# Altium schematic sheet Mainboard.SchDoc
size A4; SheetNumber: 2; SheetTotal: 2
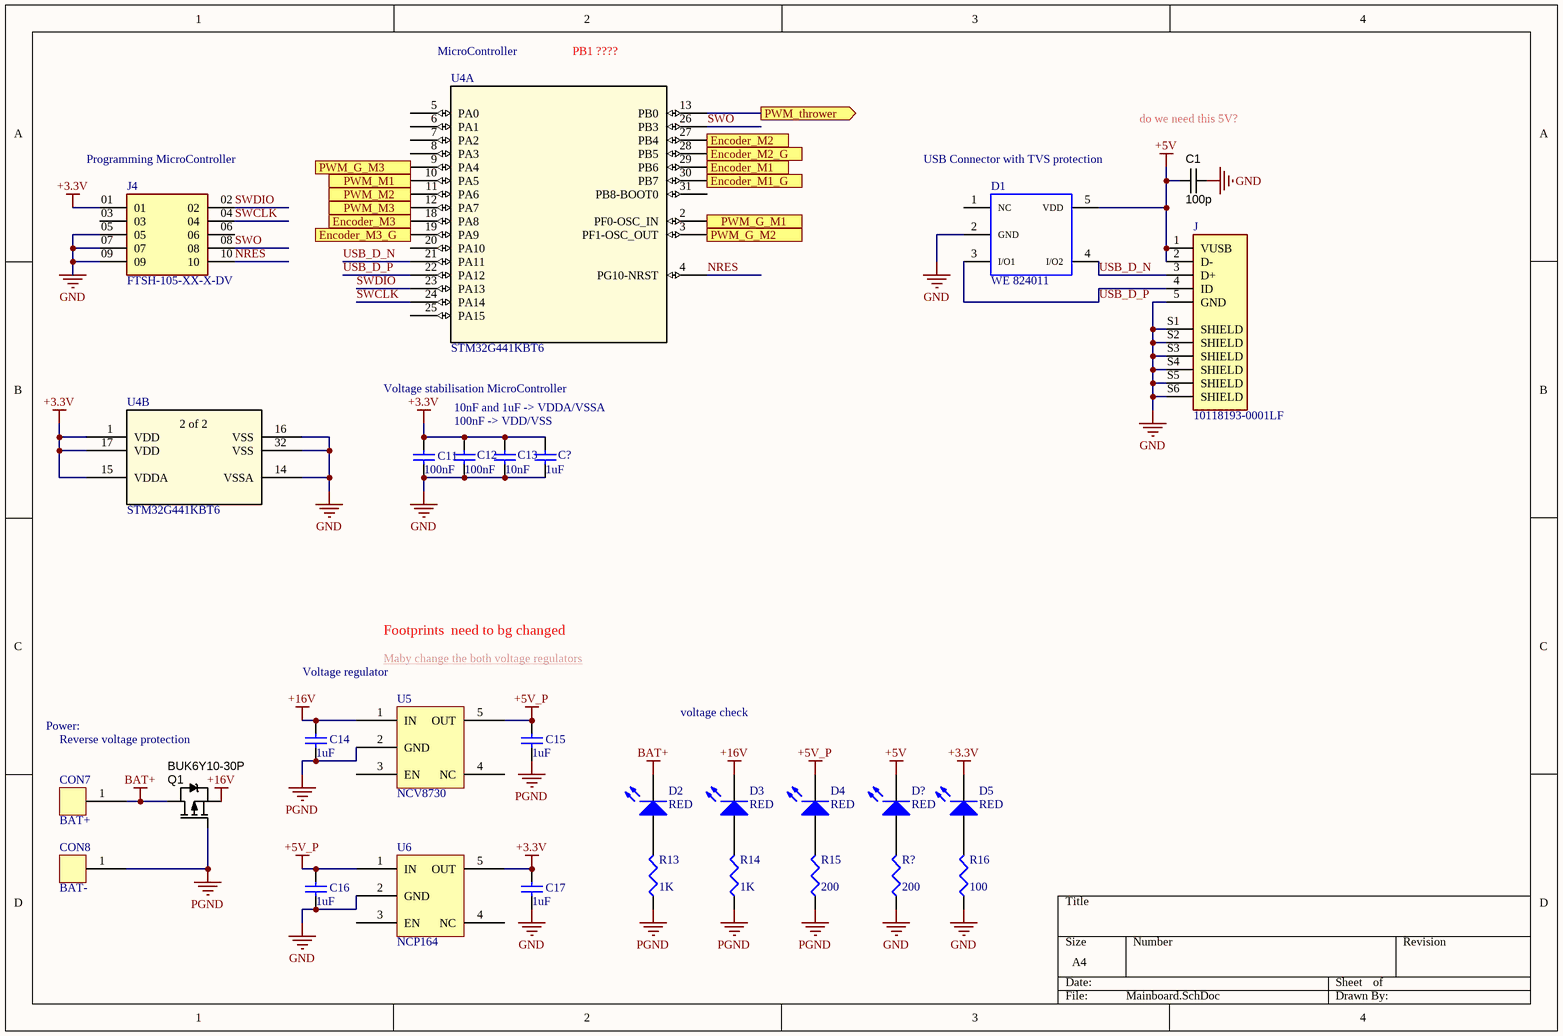
[diagram p0: Mainboard.SchDoc]

## Parts
C1  100p  [CAPC1608X90N]
C11  value 100nF  [C1206]  (hidden comment: Cap Semi)
C12  value 100nF  [C1206]  (hidden comment: Cap Semi)
C13  value 10nF  [C1206]  (hidden comment: Cap Semi)
C14  value 1uF  [C1206]  (hidden comment: Cap Semi)
C15  value 1uF  [C1206]  (hidden comment: Cap Semi)
C16  value 1uF  [C1206]  (hidden comment: Cap Semi)
C17  value 1uF  [C1206]  (hidden comment: Cap Semi)
C?  value 1uF  [C1206]  (hidden comment: Cap Semi)
CON7  BAT+  [con_soldering]
CON8  BAT-  [con_soldering]
D1  WE 824011  [WE-TVS_SOT23-5L]
D2  RED  [3.2X1.6X1.1]
D3  RED  [3.2X1.6X1.1]
D4  RED  [3.2X1.6X1.1]
D5  RED  [3.2X1.6X1.1]
D?  RED  [3.2X1.6X1.1]
J  10118193-0001LF  [FCI_10118193-0001LF]
J4  FTSH-105-XX-X-DV  [SAMTEC_FTSH-105-XX-X-DV]
Q1  BUK6Y10-30P  [TRANS_PSMN5R5-60YS,115]
R13  value 1K  [J1-0603]  (hidden comment: Res3)
R14  value 1K  [J1-0603]  (hidden comment: Res3)
R15  value 200  [J1-0603]  (hidden comment: Res3)
R16  value 100  [J1-0603]  (hidden comment: Res3)
R?  value 200  [J1-0603]  (hidden comment: Res3)
U4  STM32G441KBT6  [LQFP-32]  (parts A,B of 2)
U5  NCV8730  [NCP164CSN330T1G_Voltage_regulator]
U6  NCP164  [NCP164CSN330T1G_Voltage_regulator]

## Ports
Encoder_M1 (in), Encoder_M1_G (in), Encoder_M2 (in), Encoder_M2_G (in), Encoder_M3 (in), Encoder_M3_G (in), PWM_G_M1 (out), PWM_G_M2 (out), PWM_G_M3 (out), PWM_M1 (out), PWM_M2 (out), PWM_M3 (out), PWM_thrower (out)

## Nets
+3.3V: C11.2 C12.2 C13.2 C17.2 C?.2 D5.2(K) J4.01 U4.1(VDD) U4.15(VDDA) U4.17(VDD) U6.5(OUT)
+5V: C1.2 D1.5(VDD) D?.2(K) J.1(VUSB) J.2(D-)
+5V_P: C15.2 C16.2 D4.2(K) U5.5(OUT) U6.1(IN)
+16V: C14.2 D3.2(K) Q1.S U5.1(IN)
BAT+: CON7.1 D2.2(K) Q1.D
GND: C1.1 C11.1 C12.1 C13.1 C16.1 C17.1 C?.1 D1.2(GND) J.5(GND) J.S1(SHIELD) J.S2(SHIELD) J.S3(SHIELD) J.S4(SHIELD) J.S5(SHIELD) J.S6(SHIELD) J4.05 J4.07 J4.09 R16.1 R?.1 U4.14(VSSA) U4.16(VSS) U4.32(VSS) U6.2(GND)
PGND: C14.1 C15.1 CON8.1 Q1.G R13.1 R14.1 R15.1 U5.2(GND)
Encoder_M1: U4.29(PB6) ; port Encoder_M1
Encoder_M1_G: U4.30(PB7) ; port Encoder_M1_G
Encoder_M2: U4.27(PB4) ; port Encoder_M2
Encoder_M2_G: U4.28(PB5) ; port Encoder_M2_G
Encoder_M3: U4.18(PA8) ; port Encoder_M3
Encoder_M3_G: U4.19(PA9) ; port Encoder_M3_G
NRES: J4.10 U4.4(PG10-NRST)
PWM_G_M1: U4.2(PF0-OSC_IN) ; port PWM_G_M1
PWM_G_M2: U4.3(PF1-OSC_OUT) ; port PWM_G_M2
PWM_G_M3: U4.9(PA4) ; port PWM_G_M3
PWM_M1: U4.10(PA5) ; port PWM_M1
PWM_M2: U4.11(PA6) ; port PWM_M2
PWM_M3: U4.12(PA7) ; port PWM_M3
PWM_thrower: U4.13(PB0) ; port PWM_thrower
SWCLK: J4.04 U4.24(PA14)
SWDIO: J4.02 U4.23(PA13)
SWO: J4.08 U4.26(PB3)
USB_D_N: D1.4(I/O2) J.3(D+) U4.21(PA11)
USB_D_P: D1.3(I/O1) J.4(ID) U4.22(PA12)
NetD2_1: D2.1(A) R13.2
NetD3_1: D3.1(A) R14.2
NetD4_1: D4.1(A) R15.2
NetD5_1: D5.1(A) R16.2
NetD?_1: D?.1(A) R?.2

Not connected (* = marked no-connect by the designer): D1 1(NC); J4 03 06; U4 5(PA0) 6(PA1) 7(PA2) 8(PA3) 20(PA10) 25(PA15) 31(PB8-BOOT0); U5 3(EN) 4(NC); U6 3(EN) 4(NC)

## Notes on the sheet
- MicroController
- PB1 ????
- (near J4) Programming MicroController
- USB Connector with TVS protection
- do we need this 5V?
- Voltage stabilisation MicroController
- 10nF and 1uF -> VDDA/VSSA
- 100nF -> VDD/VSS
- Footprints  need to bg changed
- Voltage regulator
- Maby change the both voltage regulators
- voltage check
- Power:
- Reverse voltage protection
- (in symbol STM32G441KBT6, part B) 2 of 2

## Library data of the parts
C1 = CAPC_100p_0603_NP0_50V_1%: Capacitor SMD Cer 100pF 1% 50V NP0 0603; Manufacturer 1: AVX Corporation; Manufacturer Part Number 1: 06035A101FAT2A; Ratings: 50V; NP0; SCDType: source; Operating Temperature: -55°C ~ 125°C; Package / Case: 0603 (1608 Metric); Size / Dimension: 0.063" L x 0.032" W (1.60mm x 0.81mm); Thickness (Max): 0.035" (0.90mm); ComponentLink1URL: http://www.avx.com/docs/Catalogs/ccog.pdf; ComponentLink1Description: http://www.avx.com/docs/Catalogs/ccog.pdf; Supplier 1: Digi-Key; Supplier Part Number 1: 478-6202-1-ND; Supplier 2: Digi-Key; Supplier Part Number 2: 1276-2159-1-ND; Manufacturer 2: Samsung Electro-Mechanics America, Inc; Manufacturer Part Number 2: CL10C101FB8NNNC; RoHS 2: RoHS Compliant; ComponentLink2URL: http://www.samsungsem.com/servlet/FileDownload?type=spec&file=CL10C101FB8NNNC.pdf; ComponentLink2Description: http://www.samsungsem.com/servlet/FileDownload?type=spec&file=CL10C101FB8NNNC.pdf; RoHS 1: RoHS Compliant; Supplier 3: Digi-Key; Supplier Part Number 3: 399-7819-1-ND; Manufacturer 3: Kemet; Manufacturer Part Number 3: C0603C101F5GACTU; RoHS 3: RoHS Compliant; ComponentLink3URL: http://www.kemet.com/datasheets&C0603C101F5GACTU; ComponentLink3Description: http://www.kemet.com/datasheets&C0603C101F5GACTU; Tolerance: ±1%; Value: 100p
C11-C17 C? = Cap Semi: Capacitor (Semiconductor SIM Model); Published: 8-Jun-2000; LatestRevisionDate: 29-May-2009; LatestRevisionNote: IPC-7351 Footprint Added.; PackageReference: C1206; Publisher: Altium Limited; PackageDescription: Chip Capacitor
CON7 CON8 = Con_soldering
D1 = 824011: WE-TVS TVS Diode - High Speed Series, SOT23-5L, 2+1Channel, 5Vdc; Manufacturer: Wurth Elektronik; Reverse Breakdown Voltage min.: 6.1V; Channel: 2+1; Channel Input Capacitance: 2pF; Reverse Peak Pulse Current: 12A; Reverse Channel Leakage Current: 5uA; DC Operating Voltage: 5V; ComponentLink1Description: Manufacturer; ComponentLink1URL: http://www.we-online.de; ComponentLink2Description: Datasheet; ComponentLink2URL: https://www.we-online.com/catalog/datasheet/824011.pdf; Manufacturer Part Number: 824011; Published Date: April 2020; Size: SOT23-5L; Operating Temperature: -55 to +125degC; Mounting Technology: SMT; Packaging: Tape and Reel
D2-D5 D? = LED2: Typical RED, GREEN, YELLOW, AMBER GaAs LED; Published: 8-Jun-2000; LatestRevisionDate: 17-Jul-2002; LatestRevisionNote: Re-released for DXP Platform.; PackageVersion: Feb-2002; PackageReference: 3.2X1.6X1.1; Publisher: Altium Limited; PackageDescription: SM LED; 2 Flat Leads
J = 10118193-0001LF: USB - micro B USB 2.0 Receptacle Connector 5 Position Surface Mount, Right Angle; Through Hole; MF: Amphenol ICC; Availability: Unavailable; SnapEDA_Link: https://www.snapeda.com/parts/10118193-0001LF/Amphenol%20FCI/view-part/2758989/?ref=snap; MP: 10118193-0001LF; Price: None; Value: *; Package: None
J4 = FTSH-105-XX-X-DV: Connector Header Surface Mount 10 position 0.050" (1.27mm); Availability: Unavailable; Package: None; MP: FTSH-105-XX-X-DV; Price: None; Value: *
Q1 = MOSFET-P
R13-R16 R? = Res3: Resistor; Published: 8-Jun-2000; LatestRevisionDate: 29-May-2009; LatestRevisionNote: IPC-7351 Footprint Added.; PackageReference: J1-0603; Publisher: Altium Limited; PackageDescription: Chip Resistor
U4 = STM32G441KBT6: No Description Available; Mfr_Name: STMicroelectronics; Copyright: Copyright (C) 2021 Ultra Librarian. All rights reserved.; Manufacturer_Part_Number: STM32G441KBT6; Digi-Key_Part_Number_1: STM32G441KBT6-ND; RefDes: RefDes; Type: DEV